# Altium schematic sheet ADC.SchDoc: Set in Document Options » Parameters » Title
size A4; Author: Set in Document Options » Parameters » Author + Contact info
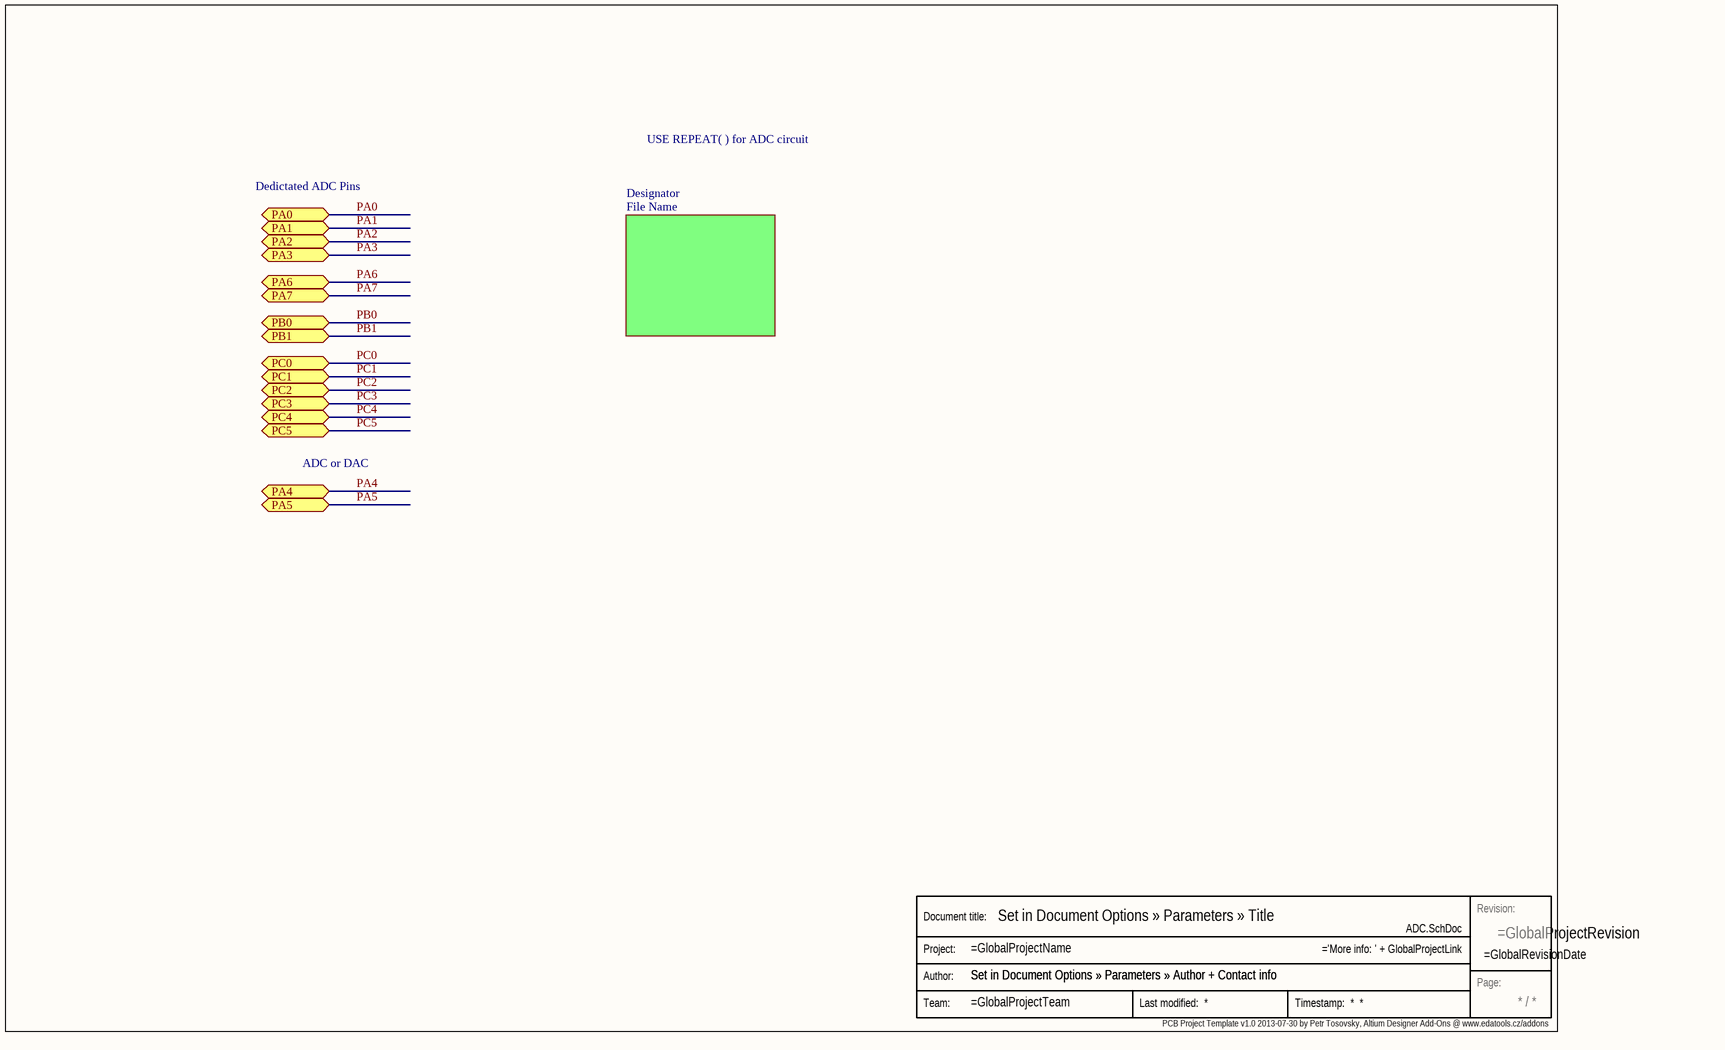
[diagram p0: ADC.SchDoc]

## Parts
Stamp  Stamp  (value not drawn)  (graphical)

## Sub-sheets
Designator = File Name: no entries

## Ports
PA0, PA1, PA2, PA3, PA4, PA5, PA6, PA7, PB0, PB1, PC0, PC1, PC2, PC3, PC4, PC5

## Nets
PA0: port PA0
PA1: port PA1
PA2: port PA2
PA3: port PA3
PA4: port PA4
PA5: port PA5
PA6: port PA6
PA7: port PA7
PB0: port PB0
PB1: port PB1
PC0: port PC0
PC1: port PC1
PC2: port PC2
PC3: port PC3
PC4: port PC4
PC5: port PC5

## Notes on the sheet
- USE REPEAT( ) for ADC circuit
- Dedictated ADC Pins
- ADC or DAC
- PCB Project Template v1.0 2013-07-30 by Petr Tosovsky, Altium Designer Add-Ons @ www.edatools.cz/addons <http://www.edatools.cz/addons>
- (in symbol Stamp) Revision:; Document title:; Project:; Author:; Page:; Team: